# Altium schematic sheet ControleSSR.SchDoc
size A3
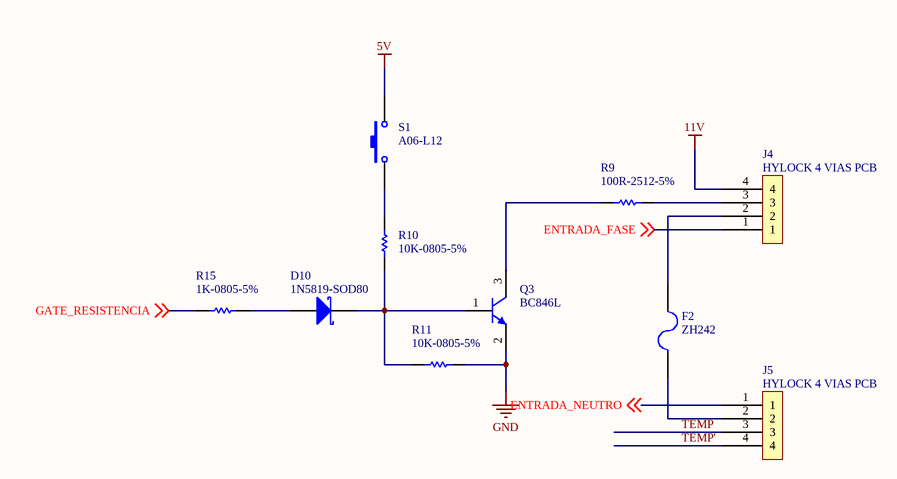
[diagram p0: ControleSSR.SchDoc]

## Parts
D10  1N5819-SOD80  [MINIMLEF/SOD80 - REVISADO ONDA]
F2  ZH242  [ZH242_REVISADO]
J4  HYLOCK 4 VIAS PCB  [CONECTOR HYLOK 4 VIAS]
J5  HYLOCK 4 VIAS PCB  [CONECTOR HYLOK 4 VIAS]
Q3  BC846L
R9  100R-2512-5%  [2512 - REVISADO ONDA]
R10  10K-0805-5%  [0805-REVISADO ONDA]
R11  10K-0805-5%  [0805-REVISADO ONDA]
R15  1K-0805-5%  [0805-REVISADO ONDA]
S1  A06-L12  [CHAVE_A06]

## Nets
5V: S1.2
11V: J4.4
GND: Q3.2(E) R11.2
ENTRADA_FASE: J4.1 ; off-sheet ENTRADA_FASE
ENTRADA_NEUTRO: J5.1 ; off-sheet ENTRADA_NEUTRO
GATE_RESISTENCIA: R15.1 ; off-sheet GATE_RESISTENCIA
TEMP: J5.3
TEMP': J5.4
NetD10_1: D10.1(A) R15.2
NetD10_2: D10.2(K) Q3.1(B) R10.1 R11.1
NetF2_1: F2.1 J4.2
NetF2_2: F2.2 J5.2
NetJ4_3: J4.3 R9.2
NetQ3_3: Q3.3(C) R9.1
NetR10_2: R10.2 S1.1

## Notes on the sheet
- NOME
- DATA
- CLIENTE
- PROJETO
- desenho
- verif.
- aprov.
- TAMANHO
- CODIGO
- Todas as informações disponíveis
- não devem ser divulgadas,
- em parte ou todo.
- www.dextro-st.com.br
- CIRCUITO IMPRESSO
- MONTAGEM ELETRÔNICA
- A4
- de

## Library data of the parts
F2 = PORTA FUSÍVEL TIPO BERÇO: ERP: 426.00.002
J4 J5 = PCMC2-4
Q3 = BC846: ERP: 106.22.001
R9 = 100R-0805-5%: ERP: 102.11.031
R10 = 1K-0805-5%: ERP: 102.11.042
D10 = 1N5819-SOD80: ERP: 121.18.003
R11 = 10K-0805-5%: ERP: 102.11.054
R15 = 1K-0805-5%: ERP: 102.11.042
S1 = A06-L12: ERP: 136.00.001